# EAGLE design Ai_Breakout_BME280 (EAGLE 7.1.0)
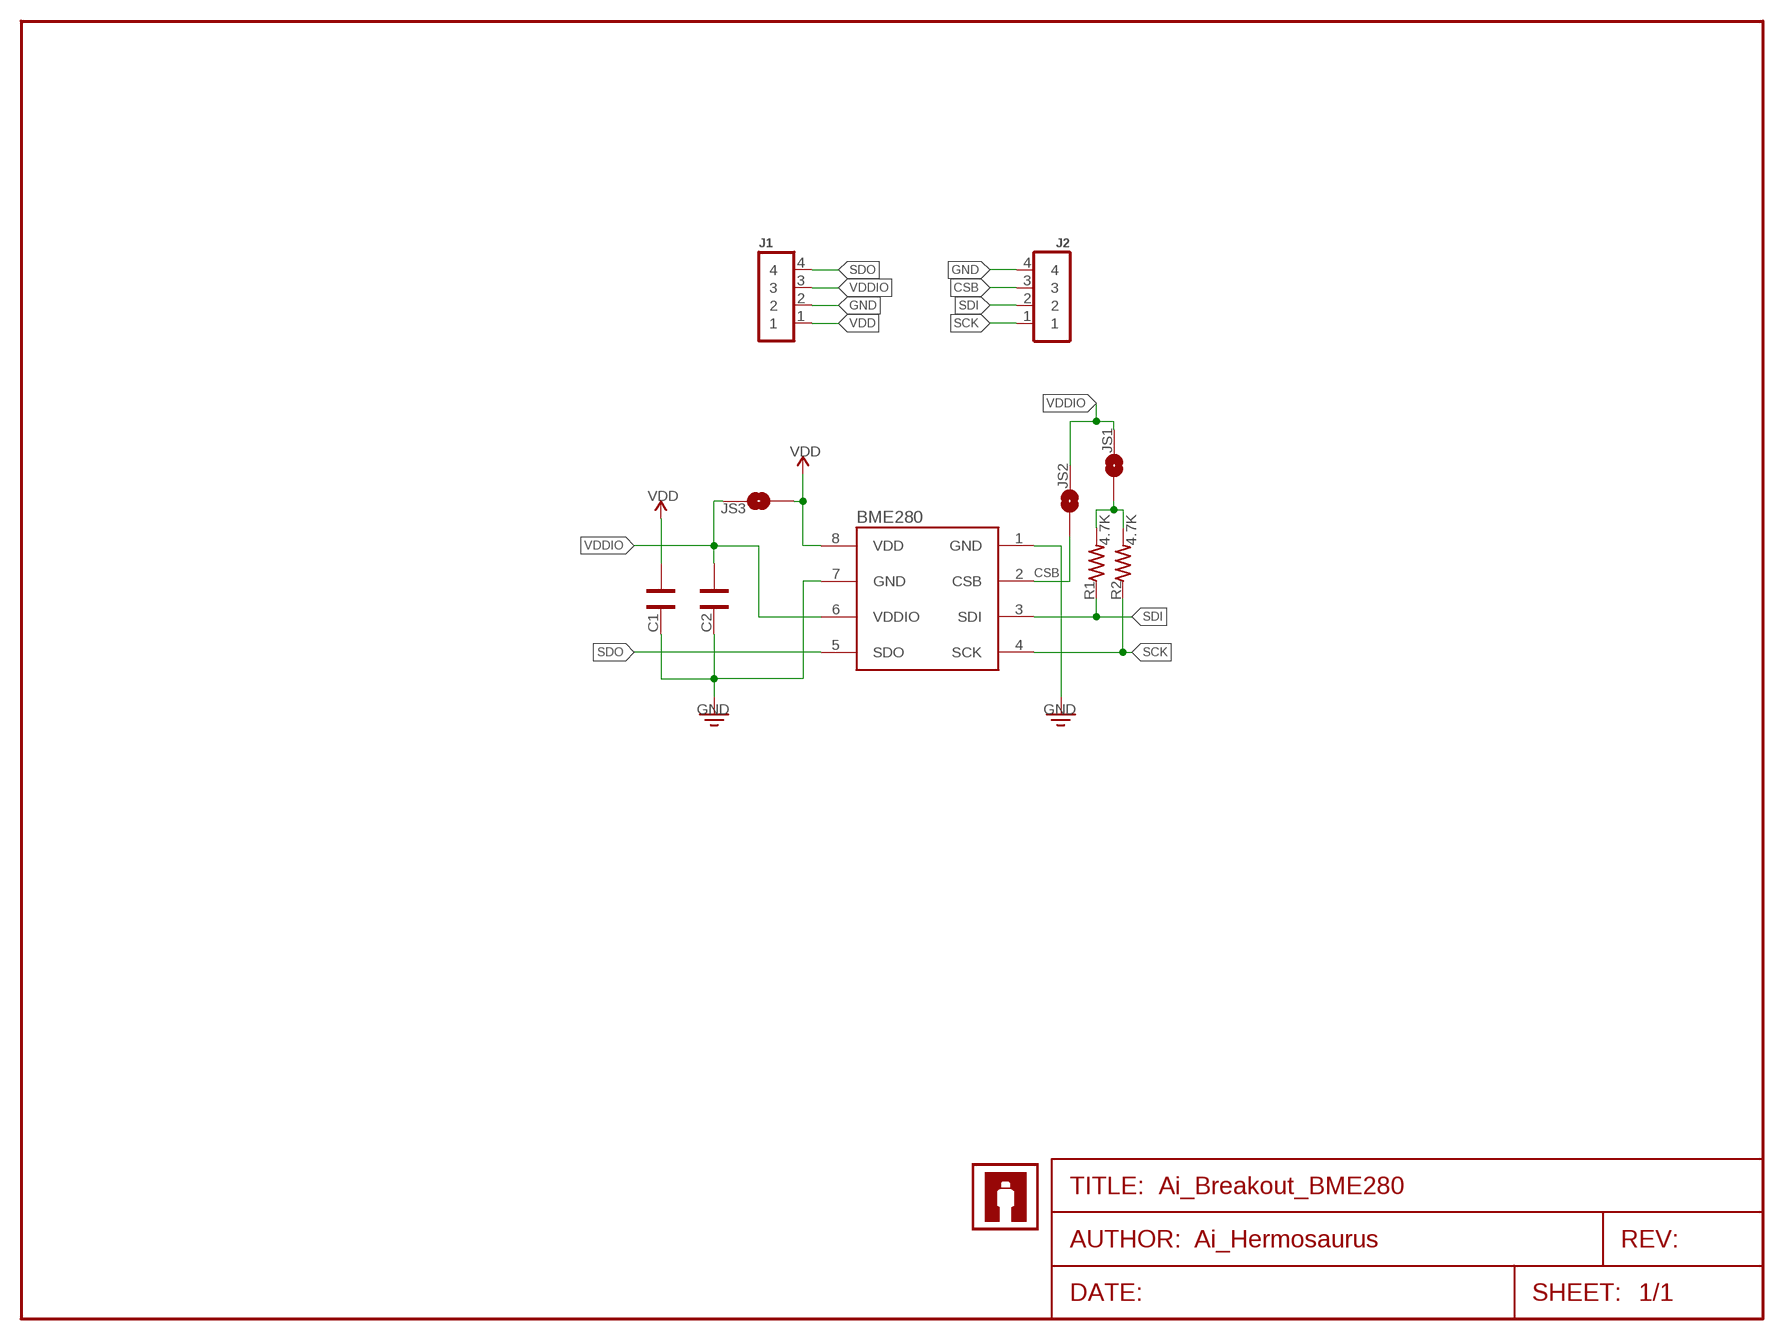
[diagram p0: schematic, sheet 1]

## Parts
C1  CAP0603  [CAP-0603]
C2  CAP0603  [CAP-0603]
J1  1X04  [1X04]
J2  1X04NOFIRST  [1X04-NOFIRST]
JS1  1X02-SJ-NO  [1X02-SJ-NO]
JS2  1X02-SJ-NO  [1X02-SJ-NO]
JS3  1X02-SJ-NO  [1X02-SJ-NO]
R1  4.7K  RES0603  [RES-0603]
R2  4.7K  RES0603  [RES-0603]
U1  BME280  [BME280]
U$2  AI-LOGOXS  [AI-LOGO-XS]

## Nets
CSB: J2.3 JS2.1 U1.2(CSB)
GND: C1.2 C2.2 J1.2 J2.4 U1.1(GND) U1.7(GND)
N$3: JS1.1 R1.2 R2.2
SCK: J2.1 R2.1 U1.4(SCK)
SDI: J2.2 R1.1 U1.3(SDI)
SDO: J1.4 U1.5(SDO)
VDD: C1.1 J1.1 JS3.1 U1.8(VDD)
VDDIO: C2.1 J1.3 JS1.2 JS2.2 JS3.2 U1.6(VDDIO)

## Notes on the sheet
- Ai_Hermosaurus

## Library data of the parts
C1 C2 = Ai_Passives:CAP
J1 J2 = Ai_Connectors:1X04
JS1-JS3 = Ai_Connectors:1X02-SJ-NO: A.I. Device 1x02-SJ-* NC has a large amount of paste (see paste layer) so that it should jumper during reflow. Remember that we have a version with a buil-in trace, which needs to be cut in order to have the jumper be NO.
R1 R2 = Ai_Passives:RES: Part # blah Digikey
U1 = Ai_Sensors:BME280
U$2 = Ai_Miscellany:AI-LOGO

## Board
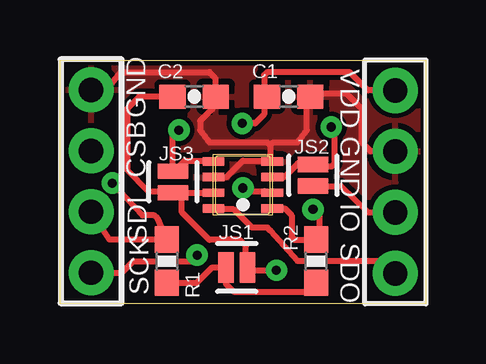
[diagram p1: board, top side]
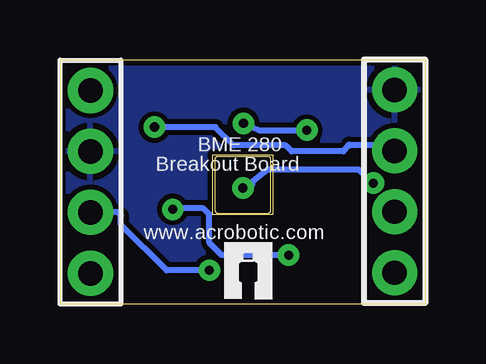
[diagram p2: board, bottom side, seen from below]

Size 15.24 x 10.16 mm. Coordinates in mm from the lower left corner, seen from the top.
Outline: 0,0 0,10.16 15.24,10.16 15.24,0 0,0
Copper layers (1*16): Top 0.035mm / dielectric 1.5mm / Bottom 0.035mm
Design rules "ai_2layer_qfn": minimum track width 7mil, minimum drill 15mil, track to track 8mil, track to pad 8mil, pad to pad 8mil, via to via 8mil, smd to smd 8mil, copper to edge 8mil, drill to drill 8mil, minimum pad ring 1mil, minimum via ring 10mil, stop-mask expansion 4mil, vias tented up to drill 20mil, thermal gap 10mil

### Footprints (pad centres in the part's own frame; a part is rotated, then mirrored left to right if it is on the bottom)
CAP-0603 = smd 1.1 x 1: 1 -0.9,0; 2 0.9,0
1X04 = drill 1.016 pad 1.88: 1 -3.81,0; 2 -1.27,0; 3 1.27,0; 4 3.81,0
1X04-NOFIRST = drill 1.016 pad 1.88: 1 -3.81,0; 2 -1.27,0; 3 1.27,0; 4 3.81,0
1X02-SJ-NO = smd 0.635 x 1.27: 1 -0.45,0; 2 0.45,0
RES-0603 = smd 1.1 x 1: 1 -0.9,0; 2 0.9,0
BME280 = smd 0.9 x 0.35: 1 1.225,0.975; 2 1.225,0.325; 3 1.225,-0.325; 4 1.225,-0.975; 5 -1.225,-0.975; 6 -1.225,-0.325; 7 -1.225,0.325; 8 -1.225,0.975

### Placement (x,y rotation side)
C1  9.53,8.64 0 top
C2  5.59,8.64 0 top
J1  13.97,5.08 270 top
J2  1.3,5.11 90 top
JS1  7.37,1.52 0 top
JS2  10.54,5.36 270 top
JS3  4.7,5.08 270 top
R1  4.45,1.78 270 top
R2  10.67,1.78 270 top
U1  7.62,4.95 0 top
U$2  8.38,0.2 0 bottom

### Tracks (layer width: path | path; a pad name or v marks a point on that pad's centre or on a via)
CSB  (via drill 0.38)
  Top 0.254: U1.2 9.34,5.28 9.91,5.84 10.61,5.84 JS2.1 11.05,5.78 10.92,5.71 11.3,5.71 11.43,5.84 11.43,7.11 11.3,7.24 v11.3,7.37
  Bottom 0.254: J2.3 1.52,6.6 3.17,6.6 3.2,6.63 3.43,6.35 5.59,6.35 5.84,6.6 8,6.6 8.76,7.37 v11.3,7.37
GND
  Top 0.254: J2.4 1.93,8.91 2.54,9.65 6.22,9.65 6.48,9.4 6.48,8.65 | 6.48,8.65 C2.2 | J1.2 12.95,6.35 12.57,6.73 12.57,8.13 11.94,8.76 10.17,8.76 C1.2 10.29,8.5 10.29,7.24 9.91,6.73 8.89,6.73 8.76,6.6 | U1.7 6.93,5.28 7.62,5.97 8.55,5.97 U1.1 8.76,6.01 8.76,6.6 | 6.48,8.65 6.36,8.65 6.35,8.26 6.35,8.13 5.84,7.62 5.84,7.24 6.22,6.73 8.64,6.73 8.76,6.6
  pour Top: 0,0 0,10.16 15.24,10.16 15.24,0
  pour Bottom: 0,0 0,10.16 15.24,10.16 15.24,0
N$3
  Top 0.254: R1.2 5.7,0.88 6.35,1.52 JS1.1 6.92,0.83 7.24,0.51 10.3,0.51 R2.2
SCK  (via drill 0.38)
  Top 0.254: U1.4 9.36,3.98 9.65,3.68 9.65,2.81 9.78,2.68 9.78,2.67 R2.1 10.79,2.81 10.79,3.81 10.67,3.94 v10.54,3.94 | J2.1 2.56,1.29 3.05,1.78 5.46,1.78 v5.71,2.03
  Bottom 0.254: v5.71,2.03 8.51,2.03 9.02,2.54 9.02,3.72 9.27,3.98 10.5,3.98 v10.54,3.94
SDI  (via drill 0.38)
  Top 0.254: J2.2 2.07,2.68 R1.1 4.06,3.56 3.94,3.68 3.43,3.68 v2.18,5.03 | v7.62,4.83 7.75,4.7 8.52,4.7 8.76,4.7 8.77,4.7 U1.3
  Bottom 0.254: v2.18,5.03 2.79,5.59 6.6,5.59 7.24,5.08 7.24,4.95 7.37,4.83 v7.62,4.83
SDO
  Top 0.254: J1.4 13.34,1.78 9.91,1.78 8.76,3.05 8.64,3.17 8,3.17 7.24,3.94 6.18,3.94 U1.5
VDD  (via drill 0.38)
  Top 0.254: J1.1 12.83,8.89 12.06,9.65 8.64,9.65 8.51,9.53 8.51,8.65 C1.1 8.5,8.5 8.51,7.9 8.13,7.52 v7.59,7.52 | U1.8 6.1,5.97 5.21,5.97 4.77,5.53 JS3.1 4.7,6.99 v4.95,7.24
  Bottom 0.254: v7.59,7.52 6.96,7.24 v4.95,7.24
VDDIO  (via drill 0.38)
  Top 0.254: JS2.2 11.7,4.91 12.83,3.81 J1.3 | C2.1 3.3,8.64 2.79,8.13 2.79,5.59 3.68,4.7 4.63,4.7 JS3.2 | 4.76,4.57 JS3.2 | JS1.2 7.82,1.84 | 7.82,1.84 7.75,2.03 7.75,2.41 7.49,2.67 6.22,2.67 5.08,3.81 5.08,4.45 JS3.2 | JS3.2 6.14,4.63 U1.6 | 7.82,1.84 7.87,1.4 v9.02,1.4
  Bottom 0.254: v9.02,1.4 10.79,1.4 12.7,3.3 12.7,3.68 12.83,3.81 J1.3

### Text on the board
tNames: VDD | GND | GND | CSB | IO | SDI | SDO | SCK
bNames: BME 280 | Breakout Board | www.acrobotic.com